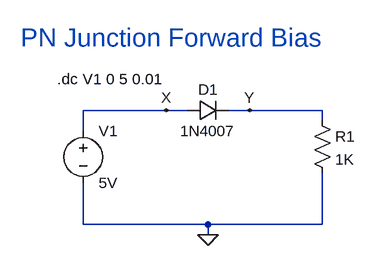
[diagram p0: schematic PN diode Forwardbias.asc]
PN diode Forwardbias.asc, the LTspice schematic file:
Version 4
SHEET 1 1064 680
WIRE 112 -176 -16 -176
WIRE 144 -176 112 -176
WIRE 240 -176 208 -176
WIRE 352 -176 240 -176
WIRE 352 -160 352 -176
WIRE -16 -144 -16 -176
WIRE -16 0 -16 -64
WIRE 176 0 -16 0
WIRE 352 0 352 -80
WIRE 352 0 176 0
WIRE 176 16 176 0
FLAG 176 16 0
FLAG 112 -176 X
FLAG 240 -176 Y
SYMBOL diode 144 -160 R270
WINDOW 0 32 32 VTop 2
WINDOW 3 0 32 VBottom 2
SYMATTR InstName D1
SYMATTR Value 1N4007
SYMBOL res 336 -176 R0
SYMATTR InstName R1
SYMATTR Value 1K
SYMBOL voltage -16 -160 R0
SYMATTR InstName V1
SYMATTR Value 5V
TEXT -56 -224 Left 2 !.dc V1 0 5 0.01
TEXT -112 -288 Left 4 ;PN Junction Forward Bias

The netlist it stands for:
* PN diode Forwardbias.asc
D1 X Y 1N4007
R1 Y 0 1K
V1 X 0 5V
.model D D
.lib standard.dio
.dc V1 0 5 0.01
* PN Junction Forward Bias
.backanno
.end